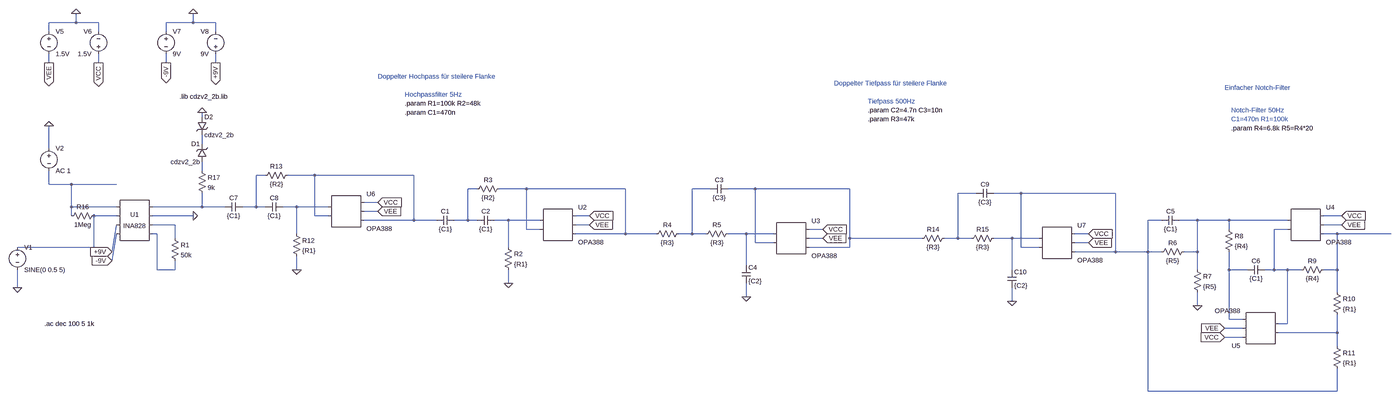
[diagram p0: schematic Signalkette_extended.asc, whole sheet]
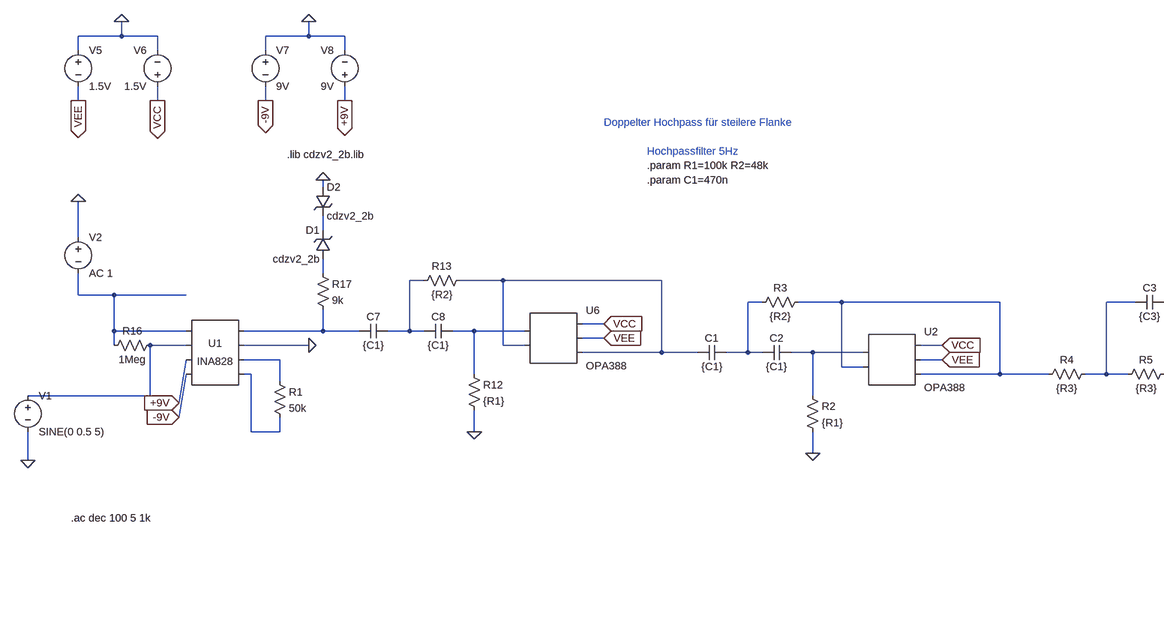
[diagram p1: schematic Signalkette_extended.asc, part, row 1 of 1, column 1 of 2]
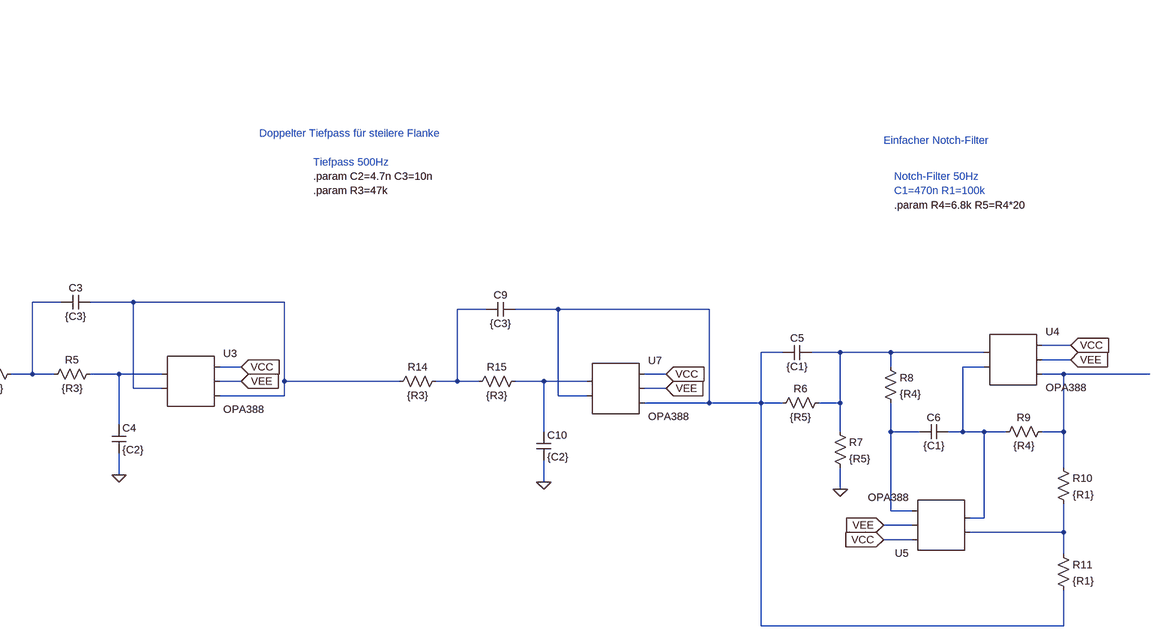
[diagram p2: schematic Signalkette_extended.asc, part, row 1 of 1, column 2 of 2]
Signalkette_extended.asc, the LTspice schematic file:
Version 4
SHEET 1 4404 1232
WIRE -496 -528 -496 -560
WIRE -496 -528 -592 -528
WIRE -416 -528 -496 -528
WIRE -80 -528 -80 -560
WIRE -80 -528 -176 -528
WIRE 0 -528 -80 -528
WIRE -592 -496 -592 -528
WIRE -416 -496 -416 -528
WIRE -176 -496 -176 -528
WIRE 0 -496 0 -528
WIRE -592 -384 -592 -416
WIRE -416 -384 -416 -416
WIRE -176 -384 -176 -416
WIRE 0 -384 0 -416
WIRE -48 -192 -48 -208
WIRE -48 -96 -48 -128
WIRE -592 -80 -592 -160
WIRE -48 0 -48 -32
WIRE 176 16 144 16
WIRE 352 16 256 16
WIRE 704 16 352 16
WIRE -592 48 -592 0
WIRE -512 48 -592 48
WIRE -352 48 -512 48
WIRE 928 64 896 64
WIRE 1104 64 1008 64
WIRE 1456 64 1104 64
WIRE 1792 64 1728 64
WIRE 1952 64 1856 64
WIRE 2288 64 1952 64
WIRE 2736 80 2672 80
WIRE 2896 80 2800 80
WIRE 3232 80 2896 80
WIRE 576 112 528 112
WIRE -512 128 -512 48
WIRE -352 128 -512 128
WIRE -48 128 -48 80
WIRE -48 128 -224 128
WIRE 32 128 -48 128
WIRE 144 128 144 16
WIRE 144 128 96 128
WIRE 176 128 144 128
WIRE 288 128 240 128
WIRE 400 128 288 128
WIRE 576 144 528 144
WIRE -512 160 -512 128
WIRE -352 160 -432 160
WIRE -80 160 -224 160
WIRE 352 160 352 16
WIRE 400 160 352 160
WIRE 1328 160 1280 160
WIRE 4160 160 4096 160
WIRE 704 176 704 16
WIRE 704 176 528 176
WIRE 784 176 704 176
WIRE 896 176 896 64
WIRE 896 176 848 176
WIRE 928 176 896 176
WIRE 1040 176 992 176
WIRE 1152 176 1040 176
WIRE 3520 176 3472 176
WIRE 3648 176 3584 176
WIRE 3760 176 3648 176
WIRE 3968 176 3760 176
WIRE -144 192 -224 192
WIRE 1328 192 1280 192
WIRE 4160 192 4096 192
WIRE 1104 208 1104 64
WIRE 1152 208 1104 208
WIRE 2192 208 2144 208
WIRE 3760 208 3760 176
WIRE 3968 208 3920 208
WIRE -208 224 -224 224
WIRE 288 224 288 128
WIRE 1456 224 1456 64
WIRE 1456 224 1280 224
WIRE 1600 224 1456 224
WIRE 1728 224 1728 64
WIRE 1728 224 1680 224
WIRE 1776 224 1728 224
WIRE 1920 224 1856 224
WIRE 2016 224 1920 224
WIRE 3136 224 3088 224
WIRE 4144 224 4096 224
WIRE 4336 224 4144 224
WIRE -144 240 -144 192
WIRE 2192 240 2144 240
WIRE 2288 240 2288 64
WIRE 2544 240 2288 240
WIRE 2672 240 2672 80
WIRE 2672 240 2624 240
WIRE 2720 240 2672 240
WIRE 2864 240 2800 240
WIRE 2960 240 2864 240
WIRE 1952 256 1952 64
WIRE 2016 256 1952 256
WIRE 3136 256 3088 256
WIRE -432 272 -432 160
WIRE -432 272 -704 272
WIRE 1040 272 1040 176
WIRE 2288 272 2288 240
WIRE 2288 272 2144 272
WIRE 2896 272 2896 80
WIRE 2960 272 2896 272
WIRE -368 288 -352 192
WIRE 3232 288 3232 80
WIRE 3232 288 3088 288
WIRE 3472 288 3472 176
WIRE 3472 288 3232 288
WIRE 3520 288 3472 288
WIRE 3648 288 3648 176
WIRE 3648 288 3600 288
WIRE -368 320 -352 224
WIRE 1920 336 1920 224
WIRE -208 352 -208 224
WIRE -144 352 -144 320
WIRE -144 352 -208 352
WIRE 288 352 288 304
WIRE 2864 352 2864 240
WIRE 3648 352 3648 288
WIRE 3760 352 3760 288
WIRE 3824 352 3760 352
WIRE 3920 352 3920 208
WIRE 3920 352 3888 352
WIRE 3968 352 3920 352
WIRE 4016 352 3968 352
WIRE 4144 352 4144 224
WIRE 4144 352 4096 352
WIRE 1040 400 1040 352
WIRE -704 416 -704 352
WIRE 4144 432 4144 352
WIRE 1920 448 1920 400
WIRE 2864 464 2864 416
WIRE 3648 480 3648 432
WIRE 3760 528 3760 352
WIRE 3808 528 3760 528
WIRE 3968 544 3968 352
WIRE 3968 544 3936 544
WIRE 3808 560 3744 560
WIRE 4144 576 4144 512
WIRE 4144 576 3936 576
WIRE 3808 592 3744 592
WIRE 4144 624 4144 576
WIRE 3472 784 3472 288
WIRE 4144 784 4144 704
WIRE 4144 784 3472 784
FLAG -704 416 0
FLAG -592 -160 0
FLAG -80 160 0
FLAG -592 -384 VEE
IOPIN -592 -384 Out
FLAG -416 -384 VCC
IOPIN -416 -384 Out
FLAG -496 -560 0
FLAG 1040 400 0
FLAG 1328 192 VEE
IOPIN 1328 192 In
FLAG 1328 160 VCC
IOPIN 1328 160 In
FLAG 1920 448 0
FLAG 2192 208 VCC
IOPIN 2192 208 In
FLAG 2192 240 VEE
IOPIN 2192 240 In
FLAG 3648 480 0
FLAG 4160 160 VCC
IOPIN 4160 160 In
FLAG 3744 592 VCC
IOPIN 3744 592 In
FLAG 4160 192 VEE
IOPIN 4160 192 In
FLAG 3744 560 VEE
IOPIN 3744 560 In
FLAG 288 352 0
FLAG 576 144 VEE
IOPIN 576 144 In
FLAG 576 112 VCC
IOPIN 576 112 In
FLAG 2864 464 0
FLAG 3136 224 VCC
IOPIN 3136 224 In
FLAG 3136 256 VEE
IOPIN 3136 256 In
FLAG -176 -384 -9V
IOPIN -176 -384 Out
FLAG 0 -384 +9V
IOPIN 0 -384 Out
FLAG -80 -560 0
FLAG -368 288 +9V
IOPIN -368 288 In
FLAG -368 320 -9V
IOPIN -368 320 In
FLAG -48 -208 0
SYMBOL voltage -704 256 R0
WINDOW 123 24 124 Left 2
WINDOW 39 0 0 Left 2
SYMATTR InstName V1
SYMATTR Value SINE(0 0.5 5)
SYMBOL voltage -592 -96 R0
WINDOW 39 0 0 Left 2
SYMATTR InstName V2
SYMATTR Value AC 1
SYMBOL res -160 224 R0
SYMATTR InstName R1
SYMATTR Value 50k
SYMBOL AutoGenerated\\INA828 -288 176 R0
SYMATTR InstName U1
SYMBOL voltage -592 -512 R0
WINDOW 123 0 0 Left 2
WINDOW 39 0 0 Left 2
SYMATTR InstName V5
SYMATTR Value 1.5V
SYMBOL voltage -416 -400 R180
WINDOW 0 24 96 Left 2
WINDOW 3 24 16 Left 2
SYMATTR InstName V6
SYMATTR Value 1.5V
SYMBOL cap 848 160 R90
WINDOW 0 0 32 VBottom 2
WINDOW 3 32 32 VTop 2
SYMATTR InstName C1
SYMATTR Value {C1}
SYMBOL cap 992 160 R90
WINDOW 0 0 32 VBottom 2
WINDOW 3 32 32 VTop 2
SYMATTR InstName C2
SYMATTR Value {C1}
SYMBOL res 1024 256 R0
SYMATTR InstName R2
SYMATTR Value {R1}
SYMBOL res 912 80 R270
WINDOW 0 32 56 VTop 2
WINDOW 3 0 56 VBottom 2
SYMATTR InstName R3
SYMATTR Value {R2}
SYMBOL AutoGenerated\\OPA388 1216 192 R0
SYMATTR InstName U2
SYMBOL res 1584 240 R270
WINDOW 0 32 56 VTop 2
WINDOW 3 0 56 VBottom 2
SYMATTR InstName R4
SYMATTR Value {R3}
SYMBOL res 1760 240 R270
WINDOW 0 32 56 VTop 2
WINDOW 3 0 56 VBottom 2
SYMATTR InstName R5
SYMATTR Value {R3}
SYMBOL cap 1792 80 R270
WINDOW 0 32 32 VTop 2
WINDOW 3 0 32 VBottom 2
SYMATTR InstName C3
SYMATTR Value {C3}
SYMBOL cap 1904 336 R0
SYMATTR InstName C4
SYMATTR Value {C2}
SYMBOL AutoGenerated\\OPA388 2080 240 R0
SYMATTR InstName U3
SYMBOL cap 3520 192 R270
WINDOW 0 32 32 VTop 2
WINDOW 3 0 32 VBottom 2
SYMATTR InstName C5
SYMATTR Value {C1}
SYMBOL res 3504 304 R270
WINDOW 0 32 56 VTop 2
WINDOW 3 0 56 VBottom 2
SYMATTR InstName R6
SYMATTR Value {R5}
SYMBOL res 3632 336 R0
SYMATTR InstName R7
SYMATTR Value {R5}
SYMBOL res 3744 192 R0
SYMATTR InstName R8
SYMATTR Value {R4}
SYMBOL AutoGenerated\\OPA388 4032 192 R0
SYMATTR InstName U4
SYMBOL cap 3824 368 R270
WINDOW 0 32 32 VTop 2
WINDOW 3 0 32 VBottom 2
SYMATTR InstName C6
SYMATTR Value {C1}
SYMBOL res 4000 368 R270
WINDOW 0 32 56 VTop 2
WINDOW 3 0 56 VBottom 2
SYMATTR InstName R9
SYMATTR Value {R4}
SYMBOL res 4128 416 R0
SYMATTR InstName R10
SYMATTR Value {R1}
SYMBOL res 4128 608 R0
SYMATTR InstName R11
SYMATTR Value {R1}
SYMBOL AutoGenerated\\OPA388 3872 560 R180
SYMATTR InstName U5
SYMBOL cap 96 112 R90
WINDOW 0 0 32 VBottom 2
WINDOW 3 32 32 VTop 2
SYMATTR InstName C7
SYMATTR Value {C1}
SYMBOL cap 240 112 R90
WINDOW 0 0 32 VBottom 2
WINDOW 3 32 32 VTop 2
SYMATTR InstName C8
SYMATTR Value {C1}
SYMBOL res 272 208 R0
SYMATTR InstName R12
SYMATTR Value {R1}
SYMBOL res 160 32 R270
WINDOW 0 32 56 VTop 2
WINDOW 3 0 56 VBottom 2
SYMATTR InstName R13
SYMATTR Value {R2}
SYMBOL AutoGenerated\\OPA388 464 144 R0
SYMATTR InstName U6
SYMBOL res 2528 256 R270
WINDOW 0 32 56 VTop 2
WINDOW 3 0 56 VBottom 2
SYMATTR InstName R14
SYMATTR Value {R3}
SYMBOL res 2704 256 R270
WINDOW 0 32 56 VTop 2
WINDOW 3 0 56 VBottom 2
SYMATTR InstName R15
SYMATTR Value {R3}
SYMBOL cap 2736 96 R270
WINDOW 0 32 32 VTop 2
WINDOW 3 0 32 VBottom 2
SYMATTR InstName C9
SYMATTR Value {C3}
SYMBOL cap 2848 352 R0
SYMATTR InstName C10
SYMATTR Value {C2}
SYMBOL AutoGenerated\\OPA388 3024 256 R0
SYMATTR InstName U7
SYMBOL voltage -176 -512 R0
WINDOW 123 0 0 Left 2
WINDOW 39 0 0 Left 2
SYMATTR InstName V7
SYMATTR Value 9V
SYMBOL voltage 0 -400 R180
WINDOW 0 24 96 Left 2
WINDOW 3 24 16 Left 2
SYMATTR InstName V8
SYMATTR Value 9V
SYMBOL res -416 144 R90
WINDOW 0 0 56 VBottom 2
WINDOW 3 32 56 VTop 2
SYMATTR InstName R16
SYMATTR Value 1Meg
SYMBOL res -64 -16 R0
SYMATTR InstName R17
SYMATTR Value 9k
SYMBOL zener -32 -32 R180
WINDOW 0 24 64 Left 2
WINDOW 3 24 0 Left 2
SYMATTR InstName D1
SYMATTR Value cdzv2_2b
SYMBOL zener -64 -192 R0
SYMATTR InstName D2
SYMATTR Value cdzv2_2b
TEXT -608 544 Left 2 !.ac dec 100 5 1k
TEXT 2352 -248 Left 2 ;Tiefpass 500Hz
TEXT 2352 -216 Left 2 !.param C2=4.7n C3=10n
TEXT 2352 -184 Left 2 !.param R3=47k
TEXT 3768 -216 Left 2 ;Notch-Filter 50Hz
TEXT 3768 -184 Left 2 ;C1=470n R1=100k
TEXT 3768 -152 Left 2 !.param R4=6.8k R5=R4*20
TEXT 672 -272 Left 2 ;Hochpassfilter 5Hz
TEXT 672 -208 Left 2 !.param C1=470n
TEXT 672 -240 Left 2 !.param R1=100k R2=48k
TEXT 576 -336 Left 2 ;Doppelter Hochpass für steilere Flanke
TEXT 2232 -312 Left 2 ;Doppelter Tiefpass für steilere Flanke
TEXT 3744 -296 Left 2 ;Einfacher Notch-Filter
TEXT -128 -264 Left 2 !.lib cdzv2_2b.lib

The netlist it stands for:
* Signalkette_extended.asc
V1 N014 0 SINE(0 0.5 5)
V2 0 N005 AC 1
R1 N017 N019 50k
* U1: INA828 (symbol AutoGenerated\INA828 not available, pins judged from their places): pin1=N005 pin2=N014 pin3=+9V pin4=-9V pin5=N012 pin6=0 pin7=N017 pin8=N019
V5 0 VEE 1.5V
V6 VCC 0 1.5V
C1 N006 N004 {C1}
C2 N015 N006 {C1}
R2 N015 0 {R1}
R3 N006 N007 {R2}
* U2: OPA388 (symbol AutoGenerated\OPA388 not available, pins judged from their places): pin1=N015 pin2=N007 pin3=VCC pin4=VEE pin5=N007
R4 N007 N008 {R3}
R5 N008 N020 {R3}
C3 N008 N009 {C3}
C4 N020 0 {C2}
* U3: OPA388 (symbol AutoGenerated\OPA388 not available, pins judged from their places): pin1=N020 pin2=N009 pin3=VCC pin4=VEE pin5=N009
C5 N011 N016 {C1}
R6 N011 N016 {R5}
R7 N016 0 {R5}
R8 N016 N023 {R4}
* U4: OPA388 (symbol AutoGenerated\OPA388 not available, pins judged from their places): pin1=N016 pin2=N018 pin3=VCC pin4=VEE pin5=N021
C6 N023 N018 {C1}
R9 N018 N021 {R4}
R10 N021 N024 {R1}
R11 N024 N011 {R1}
* U5: OPA388 (symbol AutoGenerated\OPA388 not available, pins judged from their places): pin1=N024 pin2=N018 pin3=VCC pin4=VEE pin5=N023
C7 N003 N012 {C1}
C8 N013 N003 {C1}
R12 N013 0 {R1}
R13 N003 N004 {R2}
* U6: OPA388 (symbol AutoGenerated\OPA388 not available, pins judged from their places): pin1=N013 pin2=N004 pin3=VCC pin4=VEE pin5=N004
R14 N009 N010 {R3}
R15 N010 N022 {R3}
C9 N010 N011 {C3}
C10 N022 0 {C2}
* U7: OPA388 (symbol AutoGenerated\OPA388 not available, pins judged from their places): pin1=N022 pin2=N011 pin3=VCC pin4=VEE pin5=N011
V7 0 -9V 9V
V8 +9V 0 9V
R16 N014 N005 1Meg
R17 N002 N012 9k
D1 N002 N001 cdzv2_2b
D2 0 N001 cdzv2_2b
.model D D
.lib standard.dio
.ac dec 100 5 1k
* Tiefpass 500Hz
.param C2=4.7n C3=10n
.param R3=47k
* Notch-Filter 50Hz
* C1=470n R1=100k
.param R4=6.8k R5=R4*20
* Hochpassfilter 5Hz
.param C1=470n
.param R1=100k R2=48k
* Doppelter Hochpass für steilere Flanke
* Doppelter Tiefpass für steilere Flanke
* Einfacher Notch-Filter
.lib cdzv2_2b.lib
.backanno
.end